# Altium schematic sheet ESP32.SchDoc
size A4; SheetNumber: 3; SheetTotal: 14
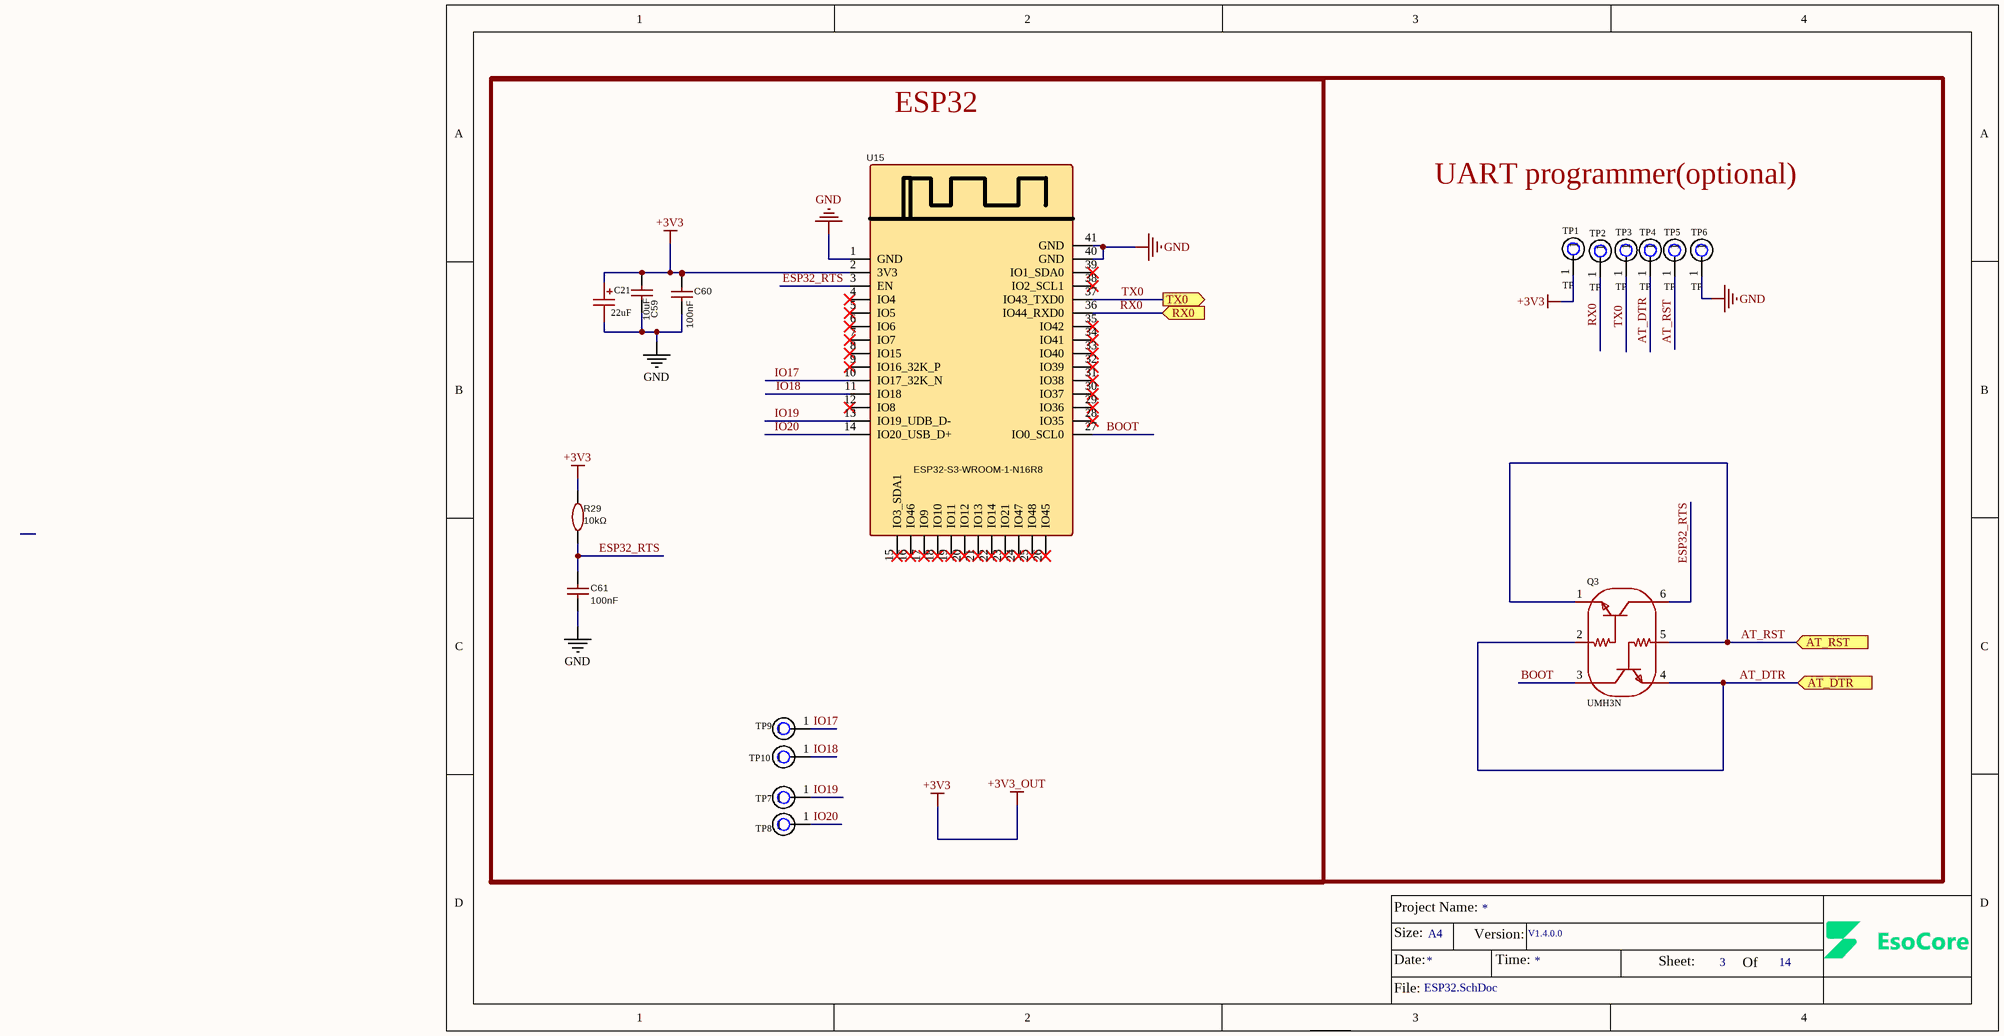
[diagram p0: ESP32.SchDoc]

## Parts
C21  22uF  [CASE-A_3216]
C59  10uF  [C_0805]
C60  100nF  [C_0805]
C61  100nF  [C_0805]
Q3  UMH3N  [SC-70-6_L2.2-W1.3-P0.65-LS2.1-BR]
R29  10kΩ  [R_0805]
TP1  TP  [TP]  (no BOM)
TP2  TP  [TP]  (no BOM)
TP3  TP  [TP]  (no BOM)
TP4  TP  [TP]  (no BOM)
TP5  TP  [TP]  (no BOM)
TP6  TP  [TP]  (no BOM)
TP7  TP  [TP]  (value not drawn)  (net tie, no BOM)
TP8  TP  [TP]  (value not drawn)  (net tie, no BOM)
TP9  TP  [TP]  (value not drawn)  (net tie, no BOM)
TP10  TP  [TP]  (value not drawn)  (net tie, no BOM)
U15  ESP32-S3-WROOM-1-N16R8  [WIRELM-SMD_ESP32-S3-WROOM-1]

## Blocks framed on the sheet
ESP32: C21 C59-C61 R29 TP7-TP10 U15
UART programmer(optional): Q3 TP1-TP6

## Ports
AT_DTR (in), AT_RST (in), RX0 (in), TX0 (out)

## Nets
+3V3: C21.1 C59.2 C60.2 R29.2 TP1.1 U15.2(3V3)  [also labelled +3V3_OUT]
GND: C21.2 C59.1 C60.1 C61.1 TP6.1 U15.1(GND) U15.40(GND) U15.41(GND)
AT_DTR: Q3.2(B) Q3.4(E) TP4.1 ; port AT_DTR
AT_RST: Q3.1(E) Q3.5(B) TP5.1 ; port AT_RST
BOOT: Q3.3(C) U15.27(IO0_SCL0)
ESP32_RTS: C61.2 Q3.6(C) R29.1 U15.3(EN)
IO17: TP9.1 U15.10(IO17_32K_N)
IO18: TP10.1 U15.11(IO18)
IO19: TP7.1 U15.13(IO19_UDB_D-)
IO20: TP8.1 U15.14(IO20_USB_D+)
RX0: TP2.1 U15.36(IO44_RXD0) ; port RX0
TX0: TP3.1 U15.37(IO43_TXD0) ; port TX0

Not connected (* = marked no-connect by the designer): U15 4(IO4)* 5(IO5)* 6(IO6)* 7(IO7)* 8(IO15)* 9(IO16_32K_P)* 12(IO8)* 15(IO3_SDA1)* 16(IO46)* 17(IO9)* 18(IO10)* 19(IO11)* 20(IO12)* 21(IO13)* 22(IO14)* 23(IO21)* 24(IO47)* 25(IO48)* 26(IO45)* 28(IO35)* 29(IO36)* 30(IO37)* 31(IO38)* 32(IO39)* 33(IO40)* 34(IO41)* 35(IO42)* 38(IO2_SCL1)* 39(IO1_SDA0)*

## Notes on the sheet
- Project Name:
- Size:
- Date:
- A4
- Version:
- Time:
- V1.4.0.0
- Sheet:
- Of
- File:

## Library data of the parts
C21 = TAJA226K010RNJ: Manufacturer: Kyocera AVX; Add into BOM: yes; Tolerance: ±10%; Voltage Rating: 10V; Equivalent Series Resistance(ESR): 3Ω@100kHz; Symbol: TAJA226K010RNJ; Device: TAJA226K010RNJ; LCSC Part Name: 22uF ±10% 10V; Supplier Part: C11366; Manufacturer Part: TAJA226K010RNJ; Supplier Footprint: CASE-A-3216-18(mm); JLCPCB Part Class: Extended Part; Supplier: LCSC; Convert to PCB: yes; Value: 22uF; Operating Temperature: -55℃~+125℃
C59 = 10uF: Manufacturer Part: CL21A106KOQNNNE; Manufacturer: SAMSUNG(三星); nameAlias: Value; Supplier: LCSC; Supplier Part: C1713; JLCPCB Part Class: Extended Part; spicePre: C; spiceSymbolName: CL21A106KOQNNNE
C60 C61 = 100nF: Manufacturer Part: CL21B104KBCNNNC; Manufacturer: SAMSUNG(三星); nameAlias: Value; Supplier: LCSC; Supplier Part: C1711; JLCPCB Part Class: Extended Part; spicePre: C; spiceSymbolName: CL21B104KBCNNNC
Q3 = UMH3N: Manufacturer: CJ(江苏长电/长晶); Add into BOM: yes; Collector - Emitter Voltage VCEO: 50V; Current - Collector(Ic): 100mA; Pd - Power Dissipation: 150mW; DC Current Gain: 100@1mA,5V; Input Resistor: 6.11kΩ; Symbol: UMH3N; Device: UMH3N; LCSC Part Name: UMH3N; Supplier Part: C62892; Manufacturer Part: UMH3N; Supplier Footprint: SC-70-6(SOT-363); JLCPCB Part Class: Extended Part; Datasheet: https://atta.szlcsc.com/upload/public/pdf/source/20151109/1457707575095.pdf; Supplier: LCSC; Convert to PCB: yes; type: -; Operating Temperature: -55℃~+150℃
R29 = 10kΩ: Manufacturer: YAGEO(国巨); Manufacturer Part: RC0805FR-0710KL; nameAlias: Value; Supplier: LCSC; Supplier Part: C84376; JLCPCB Part Class: Extended Part; spicePre: R; spiceSymbolName: RC0805FR-0710KL
U15 = ESP32-S3-WROOM-1-N16R8: Manufacturer: ESPRESSIF(乐鑫); Contributor: lcsc; Supplier: LCSC; Supplier Part: C2913202; Manufacturer Part: ESP32-S3-WROOM-1-N16R8; JLCPCB Part Class: Extended Part; spicePre: U; spiceSymbolName: ESP32-S3-WROOM-1U-N16R8